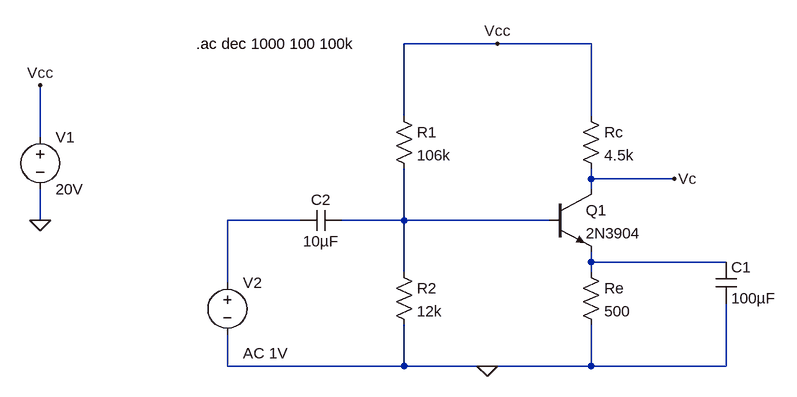
[diagram p0: schematic Mod5_Problem_2.asc]
Mod5_Problem_2.asc, the LTspice schematic file:
Version 4.1
SHEET 1 880 680
WIRE 272 -80 128 -80
WIRE 416 -80 272 -80
WIRE 128 32 128 -80
WIRE 416 32 416 -80
WIRE -432 64 -432 -16
WIRE 416 128 416 112
WIRE 544 128 416 128
WIRE 416 144 416 128
WIRE -432 192 -432 144
WIRE -32 192 -144 192
WIRE 128 192 128 112
WIRE 128 192 32 192
WIRE 352 192 128 192
WIRE 416 256 416 240
WIRE 624 256 416 256
WIRE 128 272 128 192
WIRE 416 272 416 256
WIRE -144 288 -144 192
WIRE -144 416 -144 368
WIRE 128 416 128 352
WIRE 128 416 -144 416
WIRE 256 416 128 416
WIRE 416 416 416 352
WIRE 416 416 256 416
WIRE 624 416 624 320
WIRE 624 416 416 416
FLAG 256 416 0
FLAG -432 192 0
FLAG -432 -16 Vcc
FLAG 272 -80 Vcc
FLAG 544 128 Vc
SYMBOL npn 352 144 R0
SYMATTR InstName Q1
SYMATTR Value 2N3904
SYMBOL res 400 16 R0
SYMATTR InstName Rc
SYMATTR Value 4.5k
SYMBOL res 112 16 R0
SYMATTR InstName R1
SYMATTR Value 106k
SYMBOL res 400 256 R0
SYMATTR InstName Re
SYMATTR Value 500
SYMBOL res 112 256 R0
SYMATTR InstName R2
SYMATTR Value 12k
SYMBOL voltage -432 48 R0
WINDOW 123 0 0 Left 0
WINDOW 39 0 0 Left 0
SYMATTR InstName V1
SYMATTR Value 20V
SYMBOL cap 608 256 R0
SYMATTR InstName C1
SYMATTR Value 100µF
SYMBOL voltage -144 272 R0
WINDOW 123 24 124 Left 2
WINDOW 39 0 0 Left 0
SYMATTR InstName V2
SYMATTR Value ""
SYMATTR Value2 AC 1V
SYMBOL cap 32 176 R90
WINDOW 0 0 32 VBottom 2
WINDOW 3 32 32 VTop 2
SYMATTR InstName C2
SYMATTR Value 10µF
TEXT -192 -80 Left 2 !.ac dec 1000 100 100k

The netlist it stands for:
* Mod5_Problem_2.asc
Q1 Vc N002 N003 0 2N3904
Rc Vcc Vc 4.5k
R1 Vcc N002 106k
Re N003 0 500
R2 N002 0 12k
V1 Vcc 0 20V
C1 N003 0 100µF
V2 N001 0 AC 1V
C2 N002 N001 10µF
.model NPN NPN
.model PNP PNP
.lib standard.bjt
.ac dec 1000 100 100k
.backanno
.end